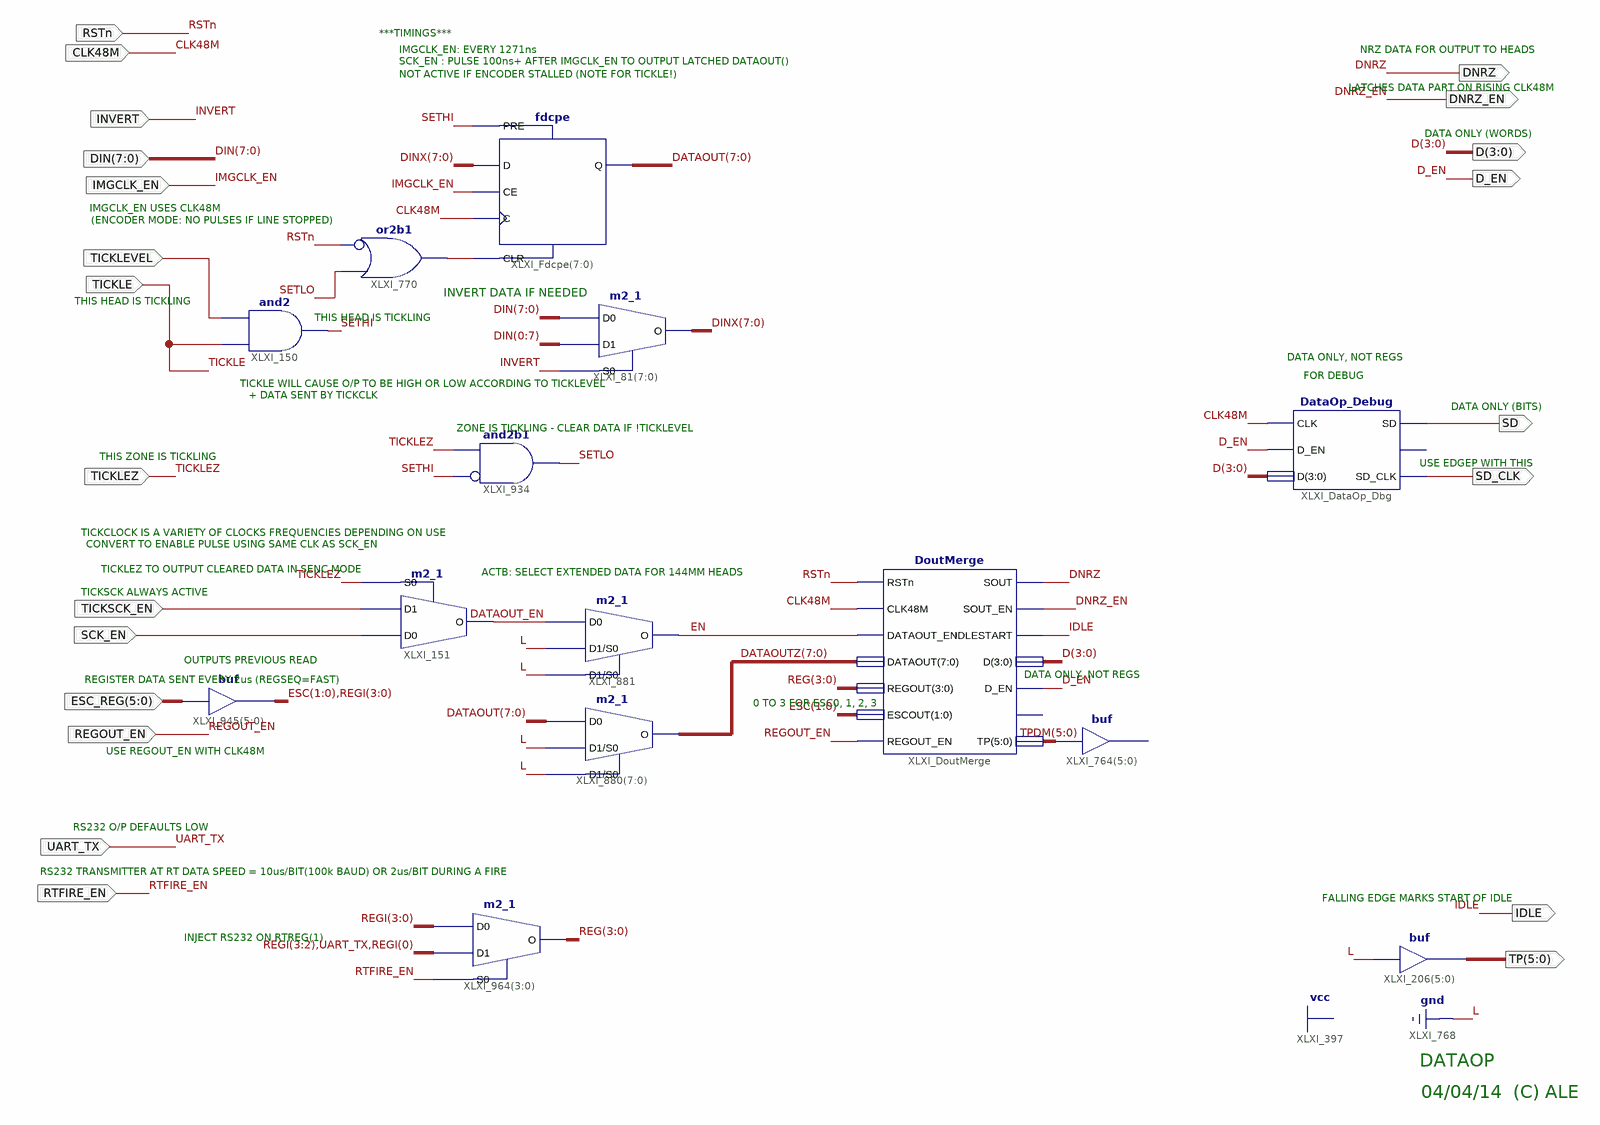
[diagram p0: schematic sheet 1]
// Xilinx ISE schematic DataOp.sch (spartan6) as structural Verilog: 14 symbols, 22 ports
module DataOp (
  input  RSTn,
  input  CLK48M,
  input  TICKLE,
  input  [7:0] DIN,
  input  TICKLEVEL,
  input  INVERT,
  input  IMGCLK_EN,
  input  TICKLEZ,
  input  SCK_EN,
  input  REGOUT_EN,
  input  TICKSCK_EN,
  input  [5:0] ESC_REG,
  input  RTFIRE_EN,
  input  UART_TX,
  output DNRZ,
  output DNRZ_EN,
  output [3:0] D,
  output D_EN,
  output [5:0] TP,
  output IDLE,
  output SD,
  output SD_CLK
);

  wire DATAOUT_EN, EN, SETHI, SETLO, XLXN_469;
  wire [1:0] ESC;
  wire [3:0] REG, REGI;
  wire [5:0] TPDM;
  wire [7:0] DATAOUT, DATAOUTZ, DINX;

  and XLXI_150 (SETHI, TICKLEVEL, TICKLE);
  or XLXI_770 (XLXN_469, ~RSTn, SETLO);  // or2b1
  fdcpe XLXI_Fdcpe[7:0] (.C(CLK48M), .CE(IMGCLK_EN), .CLR(XLXN_469), .D(DINX), .PRE(SETHI), .Q(DATAOUT));
  assign TP = {6{1'b0}};  // buf XLXI_206[5..0], 6 bits wide
  m2_1 XLXI_81[7:0] (
    .D0(DIN), .D1({DIN[0], DIN[1], DIN[2], DIN[3], DIN[4], DIN[5], DIN[6], DIN[7]}), .S0(INVERT), .O(DINX));
  and XLXI_934 (SETLO, ~SETHI, TICKLEZ);  // and2b1
  m2_1 XLXI_151 (.D0(SCK_EN), .D1(TICKSCK_EN), .S0(TICKLEZ), .O(DATAOUT_EN));
  m2_1 XLXI_881 (.D0(DATAOUT_EN), .D1(1'b0), .S0(1'b0), .O(EN));
  m2_1 XLXI_880[7:0] (.D0(DATAOUT), .D1(1'b0), .S0(1'b0), .O(DATAOUTZ));
  assign {ESC, REGI} = ESC_REG;  // buf XLXI_945[5..0], 6 bits wide
  DoutMerge XLXI_DoutMerge (
    .CLK48M(CLK48M), .D(D), .DATAOUT(DATAOUTZ), .DATAOUT_EN(EN), .D_EN(D_EN), .ESCOUT(ESC), .IDLESTART(IDLE),
    .REGOUT(REG), .REGOUT_EN(REGOUT_EN), .RSTn(RSTn), .SOUT(DNRZ), .SOUT_EN(DNRZ_EN), .TP(TPDM));  // open: R_EN
  // buf XLXI_764[5..0] has open pins: I=TPDM, O=open
  DataOp_Debug XLXI_DataOp_Dbg (.CLK(CLK48M), .D_EN(D_EN), .D(D), .SD(SD), .SD_CLK(SD_CLK));  // open: SD_EN
  m2_1 XLXI_964[3:0] (.D0(REGI), .D1({REGI[3:2], UART_TX, REGI[0]}), .S0(RTFIRE_EN), .O(REG));

  // Notes on the sheet:
  //   ***TIMINGS***
  //   IMGCLK_EN: EVERY 1271ns
  //   NRZ DATA FOR OUTPUT TO HEADS
  //   SCK_EN : PULSE 100ns+ AFTER IMGCLK_EN TO OUTPUT LATCHED DATAOUT()
  //   NOT ACTIVE IF ENCODER STALLED (NOTE FOR TICKLE!)
  //   LATCHES DATA PART ON RISING CLK48M
  //   DATA ONLY (WORDS)
  //   IMGCLK_EN USES CLK48M
  //   (ENCODER MODE: NO PULSES IF LINE STOPPED)
  //   INVERT DATA IF NEEDED
  //   THIS HEAD IS TICKLING
  //   THIS HEAD IS TICKLING
  //   DATA ONLY, NOT REGS
  //   FOR DEBUG
  //   TICKLE WILL CAUSE O/P TO BE HIGH OR LOW ACCORDING TO TICKLEVEL
  //   + DATA SENT BY TICKCLK
  //   DATA ONLY (BITS)
  //   ZONE IS TICKLING - CLEAR DATA IF !TICKLEVEL
  //   THIS ZONE IS TICKLING
  //   USE EDGEP WITH THIS
  //   TICKCLOCK IS A VARIETY OF CLOCKS FREQUENCIES DEPENDING ON USE
  //   CONVERT TO ENABLE PULSE USING SAME CLK AS SCK_EN
  //   TICKLEZ TO OUTPUT CLEARED DATA IN SENC MODE
  //   ACTB: SELECT EXTENDED DATA FOR 144MM HEADS
  //   TICKSCK ALWAYS ACTIVE
  //   OUTPUTS PREVIOUS READ
  //   DATA ONLY, NOT REGS
  //   REGISTER DATA SENT EVERY 2us (REGSEQ=FAST)
  //   0 TO 3 FOR ESC0, 1, 2, 3
  //   USE REGOUT_EN WITH CLK48M
  //   RS232 O/P DEFAULTS LOW
  //   RS232 TRANSMITTER AT RT DATA SPEED = 10us/BIT(100k BAUD) OR 2us/BIT DURING A FIRE
  //   FALLING EDGE MARKS START OF IDLE
  //   INJECT RS232 ON RTREG(1)
  //   DATAOP
  //   04/04/14  (C) ALE
endmodule
